# Altium project DM0255_R1M1E1.PrjPcb (part 1 of 2)
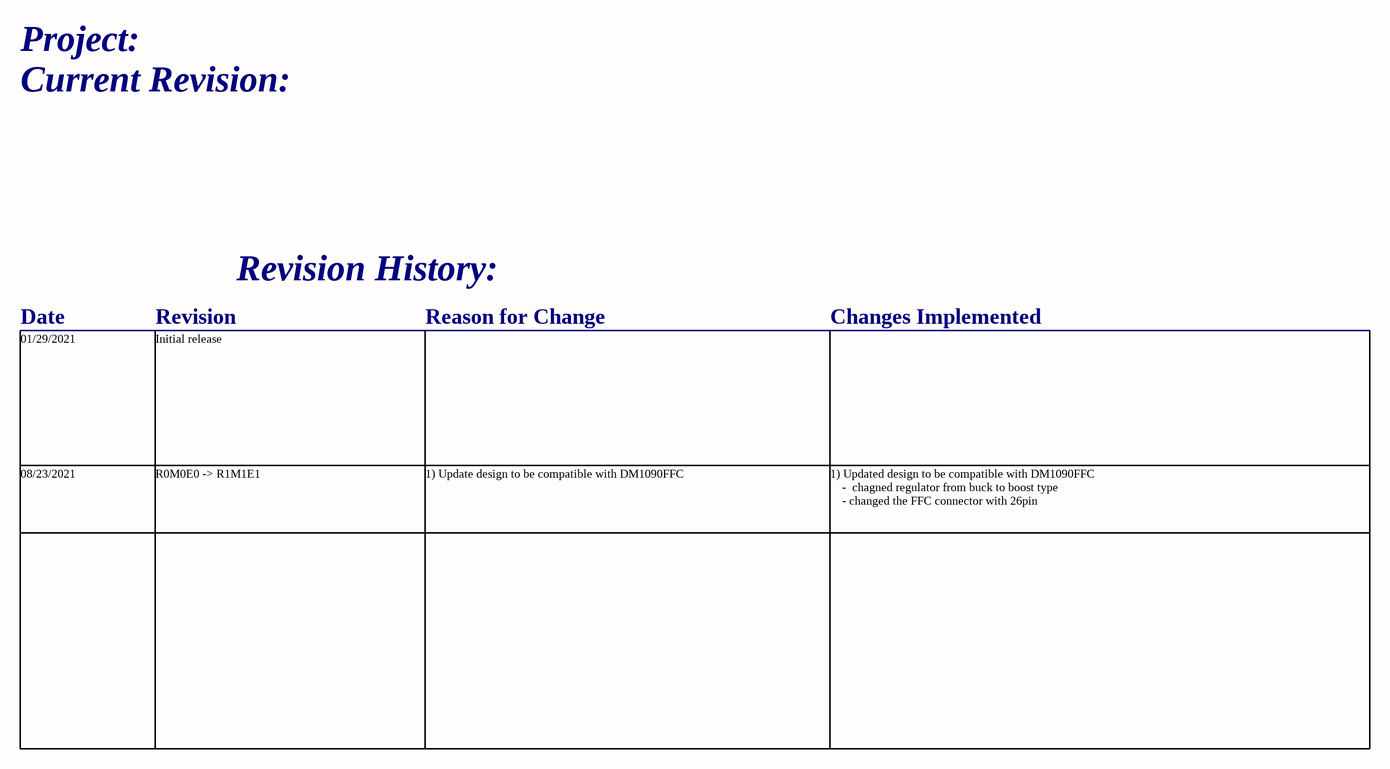
[diagram p0: Project_Information.SchDoc]
document_number: D000103; drawn_by: David Malovrh; project_title: DM0255; revision: R1M1E1
3 sheets, 54 parts. Net scope: global (net labels, ports and power ports of the same name join across sheets).
Board file: DM0255.PcbDoc
Sheets:
  Project_Information.SchDoc
  DM0255_MTP006.SchDoc
  DM0255_Power.SchDoc

## Sheet Project_Information.SchDoc: =project_title
size Tabloid; CompanyName: Luxonis Holding; DrawnBy: David Malovrh; Organization: Luxonis Holding; Address1: 1925 Harmony Park Drive; Address2: Westminster, CO; Address3: 80234; Address4: United States; DocumentNumber: D000103; Revision: R1M1E1; SheetNumber: 1; SheetTotal: 3

### Notes on the sheet
- Project:
- Current Revision:
- Revision History:
- Date
- Revision
- Reason for Change
- Changes Implemented
- 01/29/2021
- Initial release
- 08/23/2021
- R0M0E0 -> R1M1E1
- 1) Update design to be compatible with DM1090FFC
- 1) Updated design to be compatible with DM1090FFC
  -  chagned regulator from buck to boost type
  - changed the FFC connector with 26pin
- Title
- Size:
- Date:
- Tabloid
- Number:
- Time:
- Revision:
- Sheet
- of
- Drawn by:

## Sheet DM0255_MTP006.SchDoc: =project_title
size Tabloid; PageSetup: Record=PageOptions|CenterHorizontal=True|CenterVertical=True|PrintScale=0.71|XCorrection=1.00|YCorrection=1.00|PrintKind=0|BorderSize=5000000|LeftOffset=0|BottomOffset=0|Orientation=2|PaperLength=1000|PaperWidth=1000|Scale=100|PaperSource=7|PrintQuality=-4|MediaType=1|DitherType=10|PrintScaleMode=1|PaperKind=A4; CompanyName: Luxonis Holding; DrawnBy: David Malovrh; Organization: Luxonis Holding; Address1: 1925 Harmony Park Drive; Address2: Westminster, CO; Address3: 80234; Address4: United States; DocumentNumber: D000103; Revision: R1M1E1; SheetNumber: 3; SheetTotal: 3
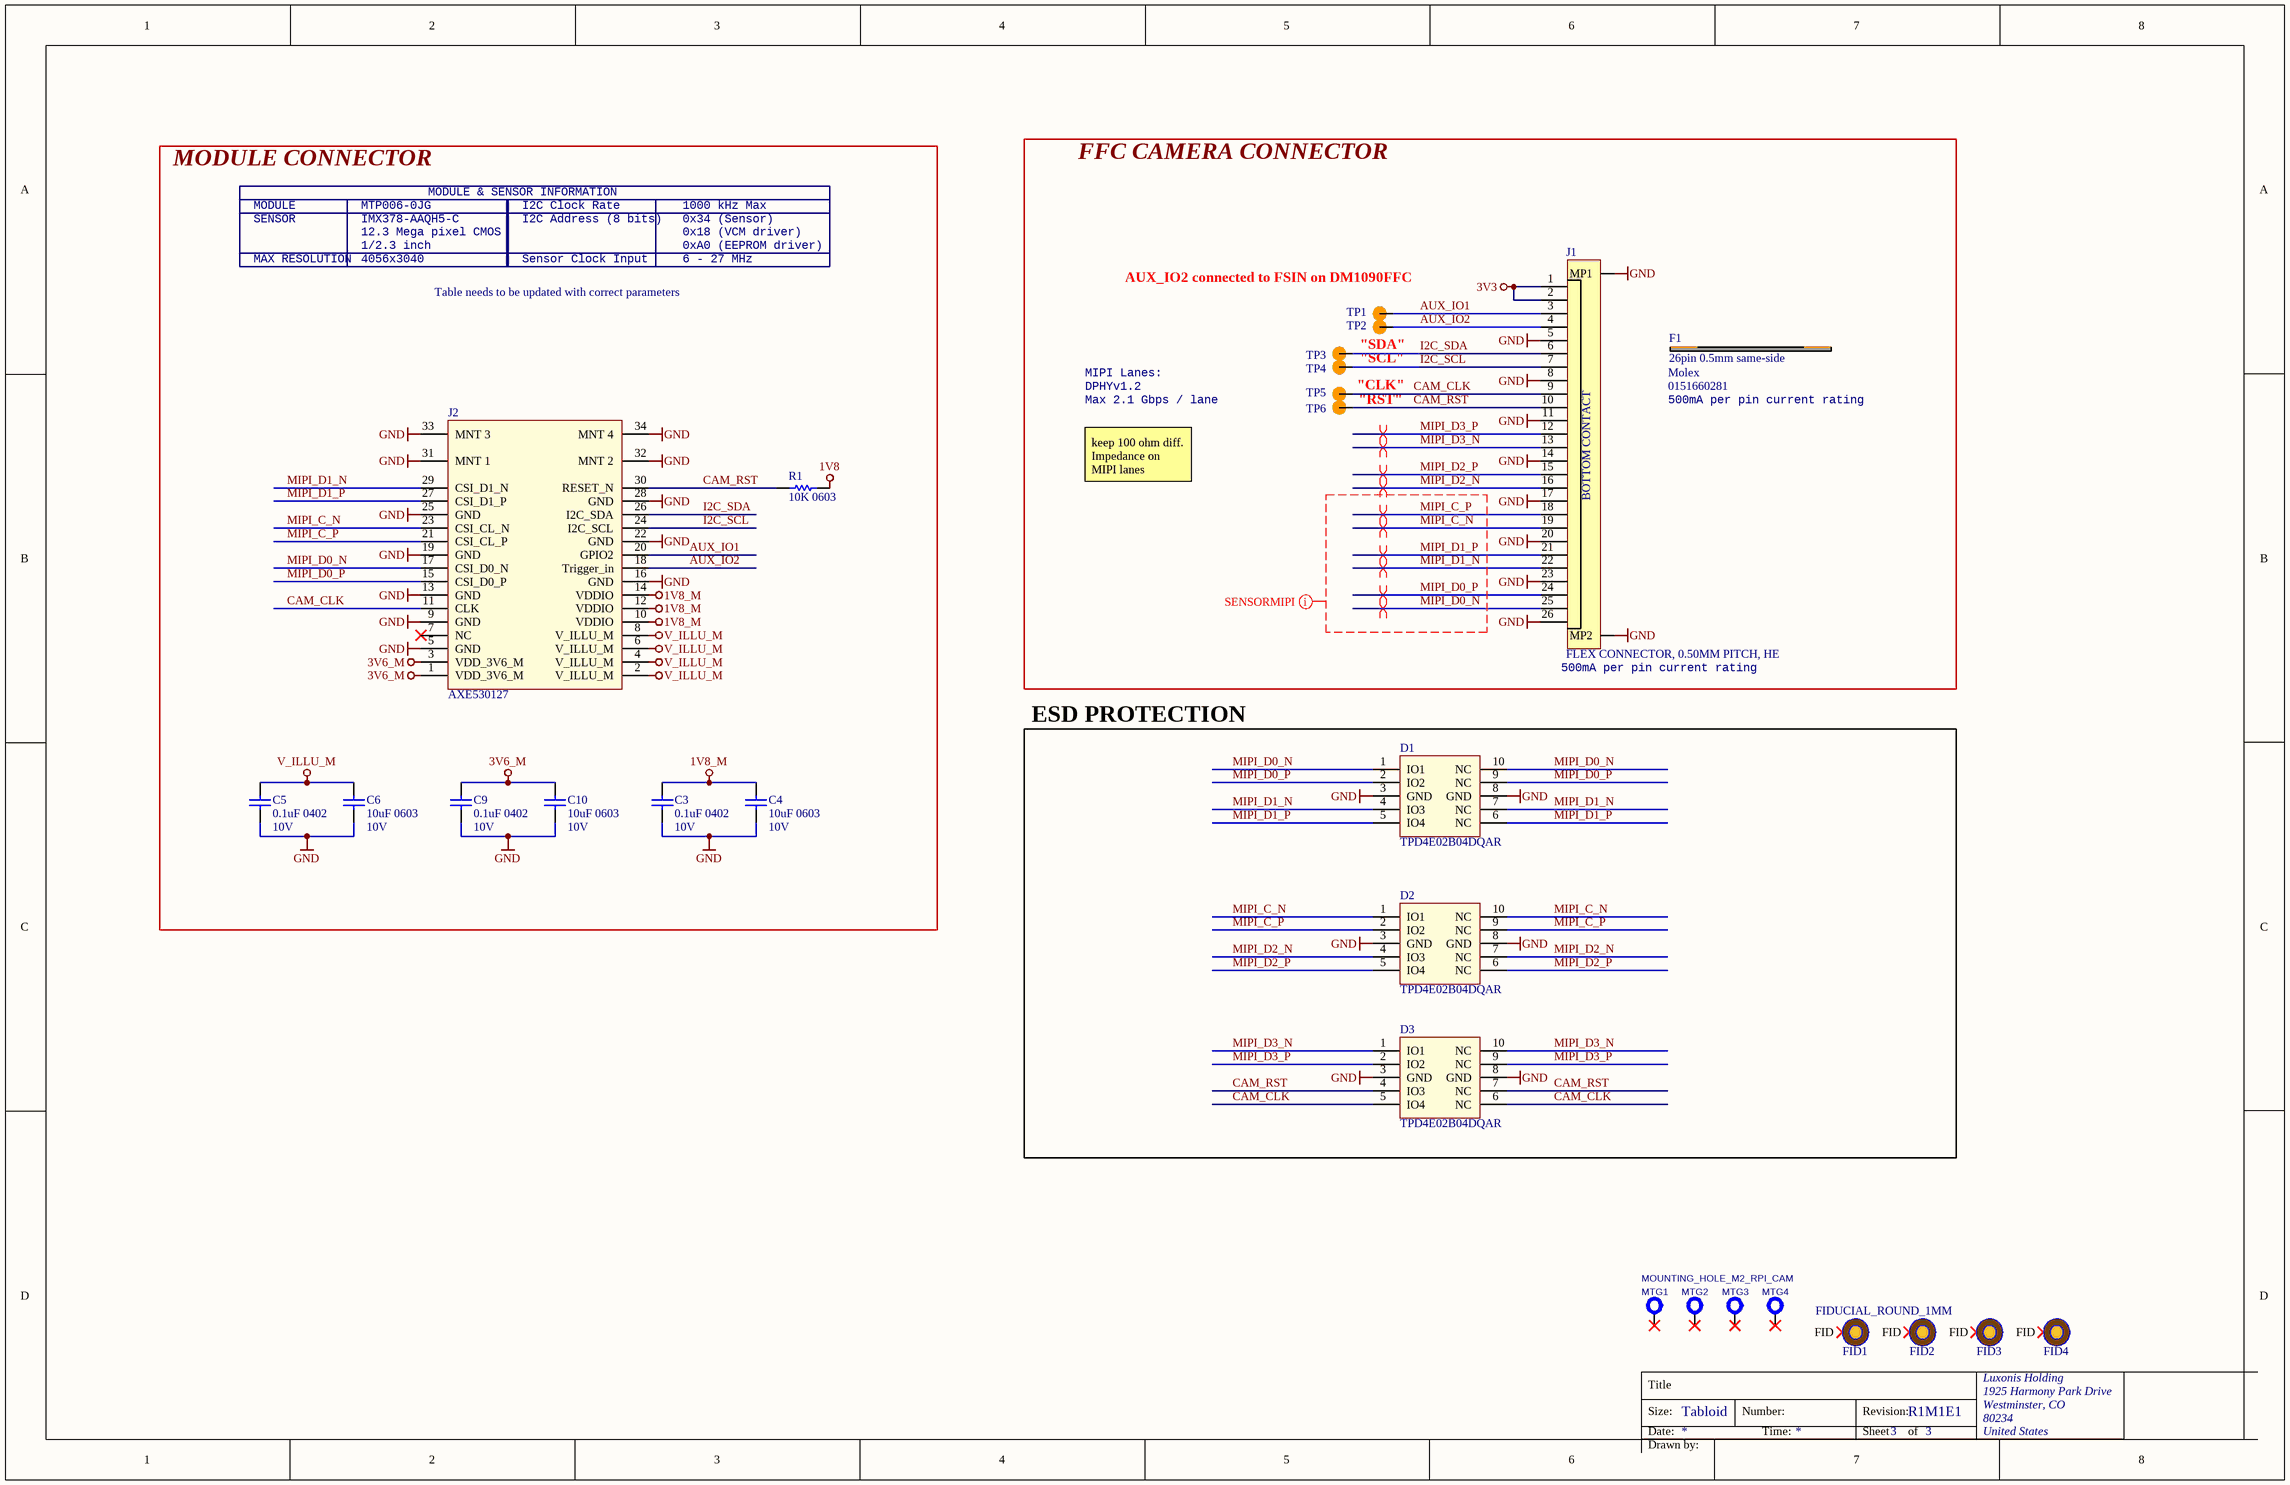
[diagram p1: DM0255_MTP006.SchDoc]

### Parts
C3  0.1uF 0402  Voltage Rating: 10V  [CAPC0402(1005)70_N]
C4  10uF 0603  Voltage Rating: 10V  [CAPC0603(1608)100_N]
C5  0.1uF 0402  Voltage Rating: 10V  [CAPC0402(1005)70_N]
C6  10uF 0603  Voltage Rating: 10V  [CAPC0603(1608)100_N]
C9  0.1uF 0402  Voltage Rating: 10V  [CAPC0402(1005)70_N]
C10  10uF 0603  Voltage Rating: 10V  [CAPC0603(1608)100_N]
D1  TPD4E02B04DQAR  [TPD4E02B04DQAR]
D2  TPD4E02B04DQAR  [TPD4E02B04DQAR]
D3  TPD4E02B04DQAR  [TPD4E02B04DQAR]
F1  26pin 0.5mm same-side  Manufacturer 1: Molex  (mechanical)
FID1  FIDUCIAL_ROUND_1MM  [FIDUCIAL_ROUND_1MM]  (no BOM)
FID2  FIDUCIAL_ROUND_1MM  [FIDUCIAL_ROUND_1MM]  (value not drawn)  (no BOM)
FID3  FIDUCIAL_ROUND_1MM  [FIDUCIAL_ROUND_1MM]  (value not drawn)  (no BOM)
FID4  FIDUCIAL_ROUND_1MM  [FIDUCIAL_ROUND_1MM]  (value not drawn)  (no BOM)
J1  FLEX CONNECTOR, 0.50MM PITCH, HE  [F32R-1A7H1-11026]
J2  AXE530127  [AXE530127]
MTG1  MOUNTING_HOLE_M2_RPI_CAM  [MOUNTING_HOLE_M2_RPI_CAM]  (no BOM)
MTG2  MOUNTING_HOLE_M2_RPI_CAM  [MOUNTING_HOLE_M2_RPI_CAM]  (value not drawn)  (no BOM)
MTG3  MOUNTING_HOLE_M2_RPI_CAM  [MOUNTING_HOLE_M2_RPI_CAM]  (value not drawn)  (no BOM)
MTG4  MOUNTING_HOLE_M2_RPI_CAM  [MOUNTING_HOLE_M2_RPI_CAM]  (value not drawn)  (no BOM)
R1  10K 0603  [RESC0603(1608)_N]
TP1  TP100_200_NS  [TP100_200_NS]  (value not drawn)  (no BOM)
TP2  TP100_200_NS  [TP100_200_NS]  (value not drawn)  (no BOM)
TP3  TP100_200_NS  [TP100_200_NS]  (value not drawn)  (no BOM)
TP4  TP100_200_NS  [TP100_200_NS]  (value not drawn)  (no BOM)
TP5  TP100_200_NS  [TP100_200_NS]  (value not drawn)  (no BOM)
TP6  TP100_200_NS  [TP100_200_NS]  (value not drawn)  (no BOM)

### Blocks framed on the sheet
MODULE CONNECTOR: C3-C6 C9 C10 J2 R1
FFC CAMERA CONNECTOR: F1 J1 TP1-TP6
ESD PROTECTION: D1-D3

### Nets
1V8: R1.2
1V8_M: C3.2 C4.2 J2.10(VDDIO) J2.12(VDDIO) J2.14(VDDIO)
3V3: J1.1 J1.2
3V6_M: C9.2 C10.2 J2.1(VDD_3V6_M) J2.3(VDD_3V6_M)
GND: C3.1 C4.1 C5.1 C6.1 C9.1 C10.1 D1.3(GND) D1.8(GND) D2.3(GND) D2.8(GND) D3.3(GND) D3.8(GND) J1.5 J1.8 J1.11 J1.14 J1.17 J1.20 J1.23 J1.26 J1.MP1 J1.MP2 J2.5(GND) J2.9(GND) J2.13(GND) J2.16(GND) J2.19(GND) J2.22(GND) J2.25(GND) J2.28(GND) J2.31(MNT_1) J2.32(MNT_2) J2.33(MNT_3) J2.34(MNT_4)
V_ILLU_M: C5.2 C6.2 J2.2(V_ILLU_M) J2.4(V_ILLU_M) J2.6(V_ILLU_M) J2.8(V_ILLU_M)
AUX_IO1: J1.3 J2.20(GPIO2) TP1.1
AUX_IO2: J1.4 J2.18(Trigger_in) TP2.1
CAM_CLK: D3.5(IO4) D3.6(NC) J1.9 J2.11(CLK) TP5.1
CAM_RST: D3.4(IO3) D3.7(NC) J1.10 J2.30(RESET_N) R1.1 TP6.1
I2C_SCL: J1.7 J2.24(I2C_SCL) TP4.1
I2C_SDA: J1.6 J2.26(I2C_SDA) TP3.1
MIPI_C_N: D2.1(IO1) D2.10(NC) J1.19 J2.23(CSI_CL_N)
MIPI_C_P: D2.2(IO2) D2.9(NC) J1.18 J2.21(CSI_CL_P)
MIPI_D0_N: D1.1(IO1) D1.10(NC) J1.25 J2.17(CSI_D0_N)
MIPI_D0_P: D1.2(IO2) D1.9(NC) J1.24 J2.15(CSI_D0_P)
MIPI_D1_N: D1.4(IO3) D1.7(NC) J1.22 J2.29(CSI_D1_N)
MIPI_D1_P: D1.5(IO4) D1.6(NC) J1.21 J2.27(CSI_D1_P)
MIPI_D2_N: D2.4(IO3) D2.7(NC) J1.16
MIPI_D2_P: D2.5(IO4) D2.6(NC) J1.15
MIPI_D3_N: D3.1(IO1) D3.10(NC) J1.13
MIPI_D3_P: D3.2(IO2) D3.9(NC) J1.12

Not connected (* = marked no-connect by the designer): FID1 FID*; FID2 FID*; FID3 FID*; FID4 FID*; J2 7(NC)*; MTG1 1*; MTG2 1*; MTG3 1*; MTG4 1*

### Layout directives
net class SENSORMIPI: MIPI_C_N, MIPI_C_P, MIPI_D0_N, MIPI_D0_P, MIPI_D1_N, MIPI_D1_P
differential pair: MIPI_C_N, MIPI_C_P, MIPI_D0_N, MIPI_D0_P, MIPI_D1_N, MIPI_D1_P, MIPI_D2_N, MIPI_D2_P, MIPI_D3_N, MIPI_D3_P

### Notes on the sheet
- SENSOR
- MODULE
- IMX378-AAQH5-C
- MTP006-0JG
- MODULE & SENSOR INFORMATION
- I2C Address (8 bits)
- I2C Clock Rate
- 0x34 (Sensor)
- 1000 kHz Max
- MAX RESOLUTION
- 12.3 Mega pixel CMOS
- 4056x3040
- 1/2.3 inch
- Table needs to be updated with correct parameters
- Sensor Clock Input
- 0x18 (VCM driver)
- 0xA0 (EEPROM driver)
- 6 - 27 MHz
- AUX_IO2 connected to FSIN on DM1090FFC
- "SCL"
- "SDA"
- MIPI Lanes:
- Max 2.1 Gbps / lane
- DPHYv1.2
- "CLK"
- "RST"
- 500mA per pin current rating
- keep 100 ohm diff. Impedance on MIPI lanes
- (near J1) 500mA per pin current rating
- Title
- Size:
- Date:
- Tabloid
- Number:
- Time:
- Revision:
- Sheet
- of
- Drawn by:
- (in symbol F32R-1A7H1-11026) BOTTOM CONTACT

### Library data of the parts
C3 C5 C9 = GRM155R71A104JA01D: CAP CER 0.1UF 10V X7R 0402 5%; Manufacturer 1: Murata; Capacitance: 100nF; Supplier 1: Digi-Key; Manufacturer Part Number 1: GRM155R71A104JA01D; Stock 1: 1346709; Pricing 1: 1=0.10000, 10=0.02500, 100=0.01130, 500=0.00806, 1000=0.00633, 2500=0.00575, 5000=0.00529 (USD); RoHS: Yes; Mount: Surface Mount; Case/Package: 0402; Case Code (Imperial): 0402; Case Code (Metric): 1005; Min Operating Temperature: -55°C; Max Operating Temperature: 125°C; Tolerance: 5%; Packaging: Tape and Reel; Voltage Rating (DC): 10V; Dielectric: X7R; Package Quantity: 10000; Termination: SMD/SMT; Length: 1mm; Height: 0.5mm; Width: 0.02inch; Thickness: 0.022inch; Depth: 0.5mm; Radiation Hardening: No; Lead Free: Lead Free; ComponentLink1URL: https://datasheet.ciiva.com/5411/product-5411135.pdf?src-supplier=Mouser; ComponentLink1Description: https://datasheet.ciiva.com/5411/product-5411135.pdf?src-supplier=Mouser; ComponentLink2URL: https://datasheet.ciiva.com/11618/c02e-11618821.pdf?src-supplier=Avnet; ComponentLink2Description: https://datasheet.ciiva.com/11618/c02e-11618821.pdf?src-supplier=Avnet; Supplier Part Number 1: 490-10777-1-ND
C4 C6 C10 = GRM188R61A106ME69D: CAP CER 10UF 10V X5R 0603 20%; Manufacturer 1: Murata; Material: Ceramic; Supplier 1: Digi-Key; Manufacturer Part Number 1: GRM188R61A106ME69D; Stock 1: 2873098; Pricing 1: 1=0.21000, 10=0.14100, 100=0.07130, 500=0.04876, 1000=0.04313 (USD); RoHS: Yes; Mount: Surface Mount; Case/Package: 0603; Weight: 0.000222oz; Case Code (Metric): 1608; Case Code (Imperial): 0603; Min Operating Temperature: -55°C; Max Operating Temperature: 85°C; Packaging: Tape and Reel; Tolerance: 20%; Capacitance: 10uF; Dielectric: X5R; Voltage Rating (DC): 10V; Package Quantity: 4000; Termination: SMD/SMT; Length: 1.6mm; Height: 0.8mm; Width: 0.8mm; Thickness: 0.035inch; Depth: 0.8mm; REACH SVHC: Unknown; Lead Free: Lead Free; ComponentLink1URL: http://www.mouser.com/ds/2/281/c02e-2905.pdf?src-supplier=Mouser; ComponentLink1Description: http://www.mouser.com/ds/2/281/c02e-2905.pdf?src-supplier=Mouser; ComponentLink2URL: http://components.arrow.com/part/dataview/0323_06119472?src-supplier=Arrow+Europe; ComponentLink2Description: http://components.arrow.com/part/dataview/0323_06119472?src-supplier=Arrow+Europe; ComponentLink3URL: http://www.farnell.com/datasheets/2048014.pdf?src-supplier=Farnell; ComponentLink3Description: http://www.farnell.com/datasheets/2048014.pdf?src-supplier=Farnell; ComponentLink4URL: http://www.farnell.com/datasheets/1872210.pdf?src-supplier=Farnell; ComponentLink4Description: http://www.farnell.com/datasheets/1872210.pdf?src-supplier=Farnell; ComponentLink5URL: http://search.murata.co.jp/Ceramy/image/img/A01X/G101/ENG/GRM188R61A106ME69-01.pdf?src-supplier=Digi-Key; ComponentLink5Description: http://search.murata.co.jp/Ceramy/image/img/A01X/G101/ENG/GRM188R61A106ME69-01.pdf?src-supplier=Digi-Key; ComponentLink6URL: http://www.farnell.com/datasheets/1872210.pdf?src-supplier=Newark; ComponentLink6Description: http://www.farnell.com/datasheets/1872210.pdf?src-supplier=Newark; ComponentLink7URL: http://www.farnell.com/datasheets/2048014.pdf?src-supplier=Element14; ComponentLink7Description: http://www.farnell.com/datasheets/2048014.pdf?src-supplier=Element14; ComponentLink8URL: http://www.farnell.com/datasheets/2048014.pdf?src-supplier=Newark; ComponentLink8Description: http://www.farnell.com/datasheets/2048014.pdf?src-supplier=Newark; Supplier Part Number 1: 490-10475-1-ND
D1-D3 = TPD4E02B04DQAR: TVS DIODE 3.6V 8.8V 10USON 8.8V (Typ) Clamp 5A (8/20µs) Ipp Tvs Diode Surface Mount 10-USON (2.5x1); Manufacturer 1: Texas Instruments; Number of Bidirectional Channels: 4; Min Breakdown Voltage: 5.5V; Peak Pulse Power: 17W; Power Line Protection: No; Interface: USB,HDMI; Supplier 1: Digi-Key; Manufacturer Part Number 1: TPD4E02B04DQAR; Stock 1: 25615; Pricing 1: 1=0.69000, 10=0.60800, 100=0.46650, 500=0.36874, 1000=0.29499 (USD); RoHS: Yes; Mount: Surface Mount; Number of Pins: 10; Min Operating Temperature: -40°C; Max Operating Temperature: 125°C; Packaging: Cut Tape; Reverse Standoff Voltage: 3.6V; Clamping Voltage: 8.8V; Operating Supply Voltage: 3.6V; Peak Pulse Current: 5A; Number of Channels: 4; Composition: Zener; REACH SVHC: No SVHC; Lead Free: Lead Free; ComponentLink1URL: http://www.ti.com/general/docs/lit/getliterature.tsp?genericPartNumber=TPD4E02B04&amp;&amp;fileType=pdf&src-supplier=Element14; ComponentLink1Description: http://www.ti.com/general/docs/lit/getliterature.tsp?genericPartNumber=TPD4E02B04&amp;&amp;fileType=pdf&src-supplier=Element14; ComponentLink2URL: http://www.ti.com/lit/ds/symlink/tpd4e02b04.pdf?src-supplier=Farnell; ComponentLink2Description: http://www.ti.com/lit/ds/symlink/tpd4e02b04.pdf?src-supplier=Farnell; ComponentLink3URL: http://www.ti.com/lit/ds/symlink/tpd4e02b04.pdf?src-supplier=Newark; ComponentLink3Description: http://www.ti.com/lit/ds/symlink/tpd4e02b04.pdf?src-supplier=Newark; ComponentLink4URL: http://www.ti.com/lit/ds/symlink/tpd4e02b04.pdf?src-supplier=Digi-Key; ComponentLink4Description: http://www.ti.com/lit/ds/symlink/tpd4e02b04.pdf?src-supplier=Digi-Key; Supplier Part Number 1: 296-43875-1-ND
F1 = 0151660281: CABLE FFC 26POS 0.50MM 6"; Number of Conductors: 26; Wire/Cable Type: Flat Flex; Pitch: 0.02inch; Supplier 1: Digi-Key; Manufacturer Part Number 1: 0151660281; Stock 1: 118; Pricing 1: 1=2.21000, 10=2.01000, 25=1.88680, 50=1.80460, 100=1.72260, 250=1.55856, 500=1.43552, 1000=1.23045, 2500=1.14842 (USD); RoHS: Yes; Number of Pins: 26; Packaging: Bulk; Package Quantity: 1000; Length: 6inch; Cable Pitch: 0.5mm; Radiation Hardening: No; ComponentLink1URL: https://datasheet.ciiva.com/10989/0151660281-cable-10989152.pdf?src-supplier=Avnet; ComponentLink1Description: https://datasheet.ciiva.com/10989/0151660281-cable-10989152.pdf?src-supplier=Avnet; ComponentLink2URL: https://datasheet.ciiva.com/2944/151660051-sd-2944673.pdf?src-supplier=Digi-Key; ComponentLink2Description: https://datasheet.ciiva.com/2944/151660051-sd-2944673.pdf?src-supplier=Digi-Key; Supplier 2: Mouser; Supplier Part Number 1: WM11334-ND; Supplier Part Number 2: 538-15166-0281
FID1-FID4 = FIDUCIAL: Fiducial with various available footprints
J1 = F32R-1A7H1-11026: 26 Position FFC, FPC Connector Contacts, Bottom 0.020" (0.50mm) Surface Mount, Right Angle; Manufacturer 1: Amphenol ICC (FCI); Number of Positions: 26; Voltage Rating: 50V; Current Rating: 500mA; Pitch: 0.02inch; Supplier 1: Digi-Key; Manufacturer Part Number 1: F32R-1A7H1-11026; RoHS: Yes; Category: Connectors; Pricing 1: 1=0.77, 10=0.721, 100=0.5529, 500=0.4808 (USD); Mount: Surface Mount; Contact Plating: Tin; Contact Material: Bronze; Min Operating Temperature: -40°C; Max Operating Temperature: 105°C; Packaging: Tape and Reel; Termination: Solder; Flammability Rating: UL94 V-0; ComponentLink1URL: https://cdn.amphenol-icc.com/media/wysiwyg/files/drawing/f32r-f32j.pdf; ComponentLink1Description: https://cdn.amphenol-icc.com/media/wysiwyg/files/drawing/f32r-f32j.pdf; Stock 1: 1709; Supplier Part Number 1: 609-F32R-1A7H1-11026CT-ND
J2 = AXE530127: Narrow Pitch Connector (Board to FPC) 0.4mm; Manufacturer 1: Panasonic; Number of Positions: 30; Connector Type: Socket; Pitch: 0.016inch; Mated Stacking Heights: 1mm; Supplier 1: Digi-Key; Manufacturer Part Number 1: AXE530127; RoHS: Yes; Category: Headers and Wire Housings; Stock 1: 21082; Pricing 1: 1=1,37000, 10=1,24800, 25=1,17120, 50=1,12020, 100=1,06940, 250=0,96752, 500=0,89114, 1000=0,76383, 2500=0,71291 (USD); Mount: Surface Mount; Number of Pins: 30; Contact Plating: Gold; Packaging: Tape and Reel; Number of Rows: 2; RoHS Compliant: Yes; ComponentLink1URL: http://www.farnell.com/datasheets/2643909.pdf?src-supplier=Farnell; ComponentLink1Description: http://www.farnell.com/datasheets/2643909.pdf?src-supplier=Farnell; ComponentLink2URL: http://www3.panasonic.biz/ac/e_download/control/connector/base-fpc/catalog/con_eng_a4s.pdf?src-supplier=Digi-Key; ComponentLink2Description: http://www3.panasonic.biz/ac/e_download/control/connector/base-fpc/catalog/con_eng_a4s.pdf?src-supplier=Digi-Key; Supplier Part Number 1: 255-5287-1-ND
MTG1-MTG4 = MP_Mounting-Holes: =CurrentFootprint; B - Value: Not a Part; A - Level: 0
R1 = RC0603FR-0710KL: RES SMD 10K OHM 1% 1/10W 0603; Manufacturer 1: Yageo; Resistance: 10kR; Power Rating: 100mW; Temperature Coefficient: 100ppm/°C; Voltage Rating: 75V; Voltage Rating (DC): 50V; Supplier 1: Digi-Key; Manufacturer Part Number 1: RC0603FR-0710KL; Stock 1: 80414305; Pricing 1: 1=0.10000, 10=0.02200, 100=0.00890, 1000=0.00401, 2500=0.00348 (USD); RoHS: Yes; Case/Package: 0603; Number of Pins: 2; Weight: 7.1E-05oz; Case Code (Imperial): 0603; Case Code (Metric): 1608; Min Operating Temperature: -55°C; Max Operating Temperature: 155°C; Packaging: Tape and Reel; Tolerance: 1%; Composition: Thick Film; Termination: SMD/SMT; Military Standard: Not; Length: 1.6mm; Height: 0.45mm; Depth: 0.8mm; Width: 0.8mm; Lead Pitch: 0.3mm; Lead Free: Lead Free; REACH SVHC: No SVHC; ComponentLink1URL: https://datasheet.ciiva.com/7660/38590-7660789.pdf?src-supplier=Element14; ComponentLink1Description: https://datasheet.ciiva.com/7660/38590-7660789.pdf?src-supplier=Element14; ComponentLink2URL: https://datasheet.ciiva.com/15189/getdatasheetpartid-409289-15189591.pdf?src-supplier=Verical; ComponentLink2Description: https://datasheet.ciiva.com/15189/getdatasheetpartid-409289-15189591.pdf?src-supplier=Verical; ComponentLink3URL: https://datasheet.ciiva.com/46440/1868787-46440891.pdf?src-supplier=Element14; ComponentLink3Description: https://datasheet.ciiva.com/46440/1868787-46440891.pdf?src-supplier=Element14; ComponentLink4URL: https://datasheet.ciiva.com/7983/443971-7983596.pdf?src-supplier=Element14; ComponentLink4Description: https://datasheet.ciiva.com/7983/443971-7983596.pdf?src-supplier=Element14; ComponentLink5URL: https://datasheet.ciiva.com/7746/1738695-7746239.pdf?src-supplier=Element14; ComponentLink5Description: https://datasheet.ciiva.com/7746/1738695-7746239.pdf?src-supplier=Element14; ComponentLink6URL: https://datasheet.ciiva.com/22747/443971-22747519.pdf?src-supplier=Element14; ComponentLink6Description: https://datasheet.ciiva.com/22747/443971-22747519.pdf?src-supplier=Element14; Supplier 2: Digi-Key; Manufacturer 2: Yageo; Manufacturer Part Number 2: RC0603FR-0710KL; Stock 2: 80414305; Pricing 2: 1=0.10000, 10=0.02200, 100=0.00890, 1000=0.00401, 2500=0.00348 (USD); Supplier 3: Digi-Key; Manufacturer 3: Yageo; Manufacturer Part Number 3: RC0603FR-0710KL; Stock 3: 80410000; Pricing 3: 5000=0.00261, 10000=0.00227, 25000=0.00199, 50000=0.00183, 125000=0.00179 (USD); Supplier Part Number 1: 311-10.0KHRCT-ND; Supplier Part Number 2: 311-10.0KHRDKR-ND; Supplier Part Number 3: 311-10.0KHRTR-ND
TP1-TP6 = TEST_POINT